# EAGLE schematic Placa_main_f3 (EAGLE 9.6.2)

## Sheet 1 of 7
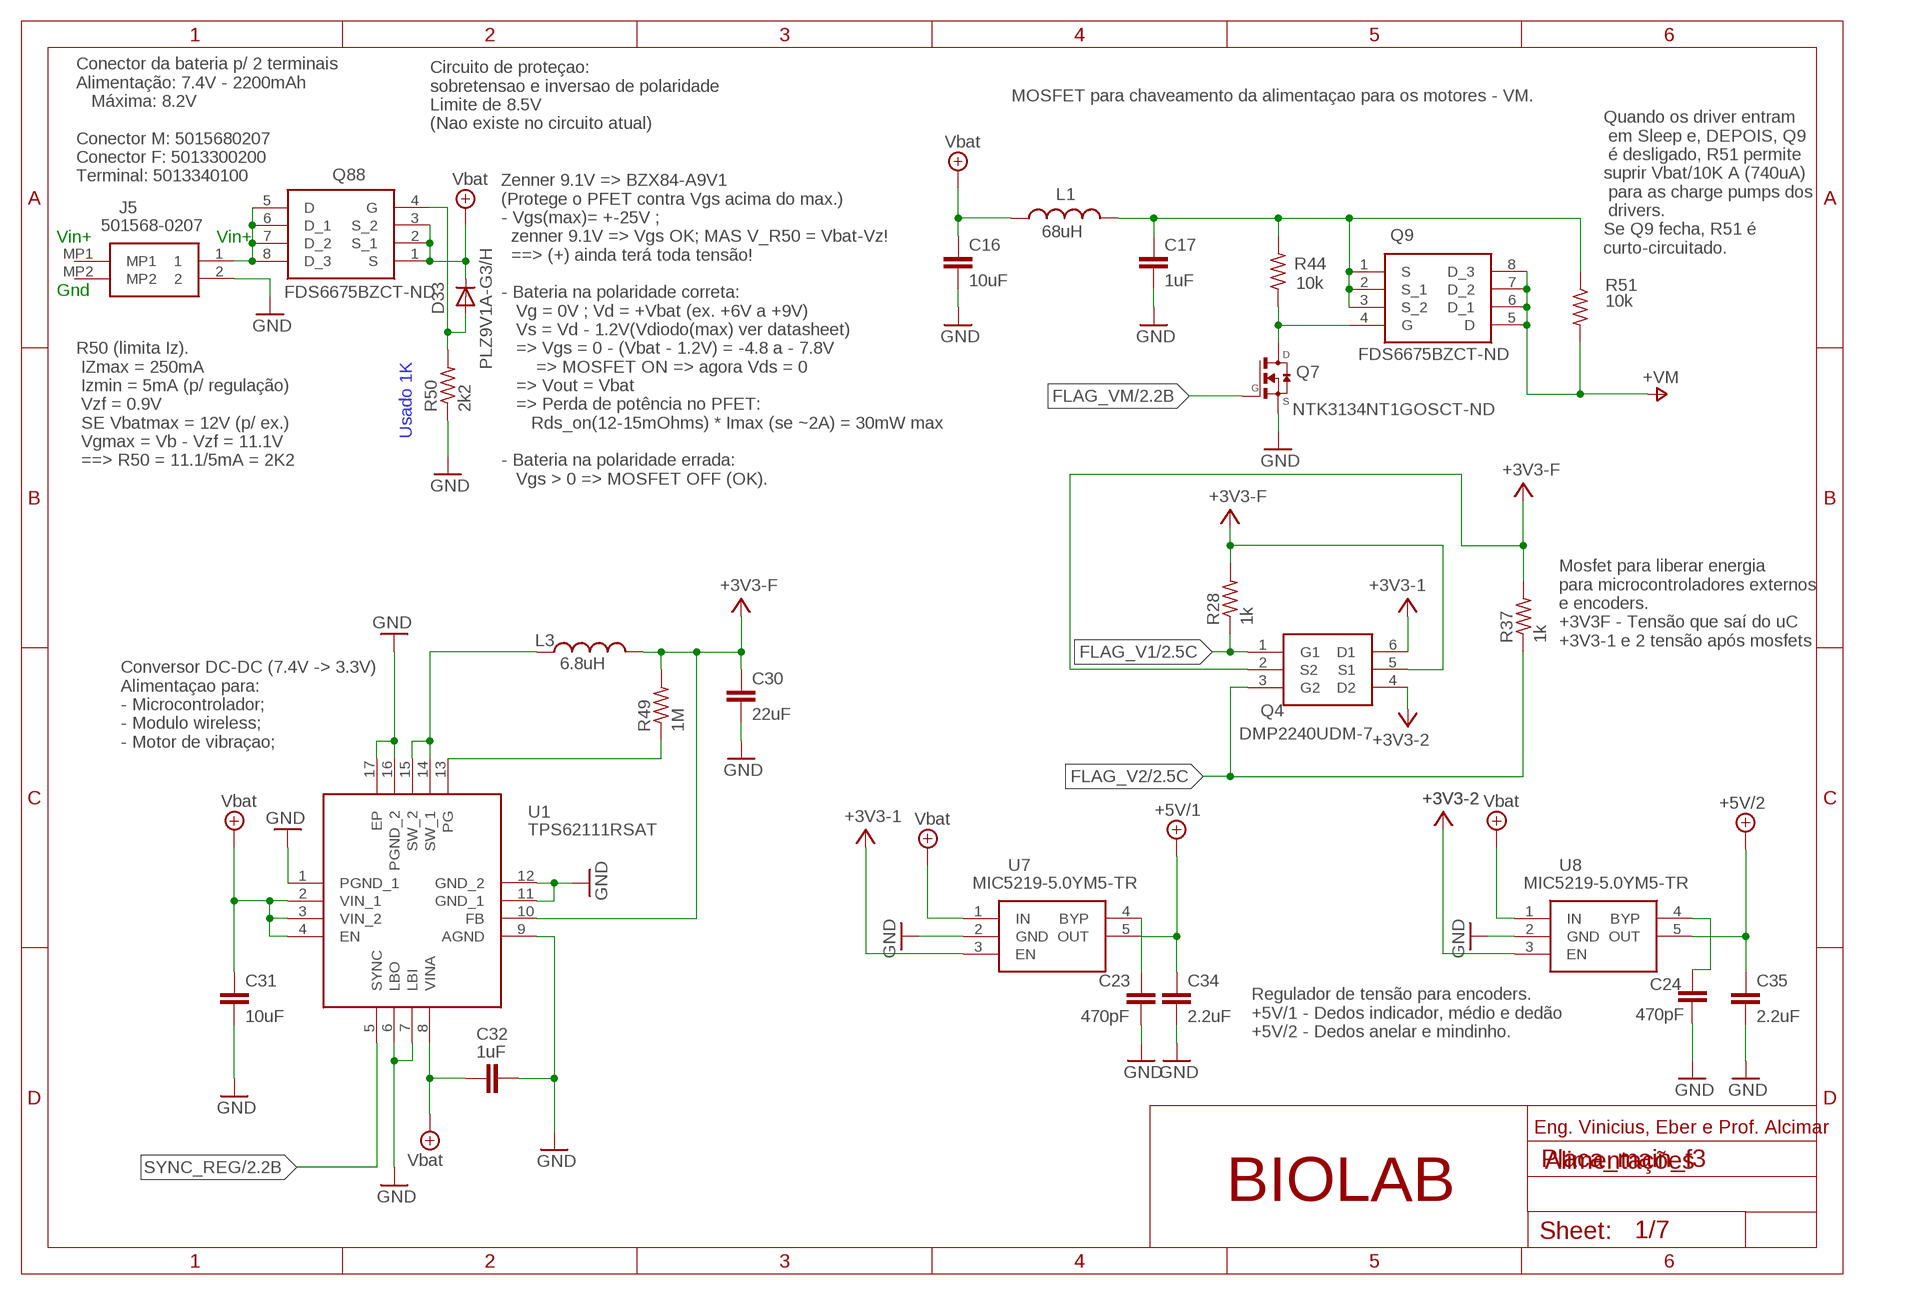
[diagram p0: schematic, sheet 1]

### Parts
C16  10uF  C-EUC0805K  [C0805K]
C17  1uF  C-EUC0402K  [C0402K]
C23  470pF  C-EUC0402K  [C0402K]
C24  470pF  C-EUC0402K  [C0402K]
C30  22uF  C-EUC0805K  [C0805K]
C31  10uF  C-EUC0805K  [C0805K]
C32  1uF  C-EUC0402K  [C0402K]
C34  2.2uF  C-EUC0402K  [C0402K]
C35  2.2uF  C-EUC0402K  [C0402K]
D33  PLZ9V1A-G3/H  DIODE-MINIMELF  [MINIMELF]
J5  501568-0207  [5015680207]
L1  68uH  L-USL2825P  [L2825P]
L3  6.8uH  L-USL2825P  [L2825P]
Q4  DMP2240UDM-7  [SOT95P285X140-6N]
Q7  NTK3134NT1GOSCT-ND  FDV303N  [SOT23]
Q9  FDS6675BZCT-ND  FDS6675BZ  [SOIC127P600X175-8N]
Q88  FDS6675BZCT-ND  FDS6675BZ  [SOIC127P600X175-8N]
R28  1k  R-US_R0402  [R0402]
R37  1k  R-US_R0402  [R0402]
R44  10k  R-US_R0402  [R0402]
R49  1M  R-US_R0402  [R0402]
R50  2k2  R-US_R0402  [R0402]
R51  10k  R-US_R0402  [R0402]
U1  TPS62111RSAT  [QFN65P400X400X100-17N]
U7  MIC5219-5.0YM5-TR  [SOT95P280X145-5N]
U8  MIC5219-5.0YM5-TR  [SOT95P280X145-5N]

### Nets
+3V3: C30.1 L3.2 Q4.2(S2) Q4.5(S1) R28.2 R37.2 R49.2 U1.10(FB) U7.3(EN) ; supply symbol labelled +3V3-F, +3V3-1 ; also sheet 2,3,5,6,7
+3V3-1: Q4.6(D1) ; also sheet 4
+3V3-2: Q4.4(D2) U8.3(EN) ; also sheet 4
+5V/1: C34.1 U7.5(OUT) ; also sheet 3,4
+5V/2: C35.1 U8.5(OUT) ; also sheet 4
FLAG_V1: Q4.1(G1) R28.1 ; also sheet 2
FLAG_V2: Q4.3(G2) R37.1 ; also sheet 2
FLAG_VM: Q7.1(G) ; also sheet 2
GND: C16.2 C17.2 C23.2 C24.2 C30.2 C31.2 C32.2 C34.2 C35.2 J5.2 Q7.2(S) R50.1 U1.1(PGND_1) U1.6(LBO) U1.7(LBI) U1.9(AGND) U1.11(GND_1) U1.12(GND_2) U1.16(PGND_2) U1.17(EP) U7.2(GND) U8.2(GND) ; also sheet 2,3,4,5,6,7
N$9: C17.1 L1.2 Q9.1(S) Q9.2(S_1) Q9.3(S_2) R44.2 R51.1
N$10: Q7.3(D) Q9.4(G) R44.1
N$11: C24.1 U8.4(BYP)
N$12: C23.1 U7.4(BYP)
N$14: R49.1 U1.13(PG)
N$15: L3.1 U1.14(SW_1) U1.15(SW_2)
N$16: D33.A Q88.4(G) R50.2
SYNC_REG: U1.5(SYNC) ; also sheet 2
V+: Q9.5(D) Q9.6(D_1) Q9.7(D_2) Q9.8(D_3) R51.2 ; supply symbol labelled +VM ; also sheet 3,4,5
VBAT: C16.1 C31.1 C32.1 D33.C L1.1 Q88.1(S) Q88.2(S_1) Q88.3(S_2) U1.2(VIN_1) U1.3(VIN_2) U1.4(EN) U1.8(VINA) U7.1(IN) U8.1(IN) ; supply symbol labelled Vbat ; also sheet 2
VIN+: J5.1 Q88.5(D) Q88.6(D_1) Q88.7(D_2) Q88.8(D_3)
Unconnected: J5.MP1 J5.MP2

### Notes on the sheet
- MOSFET para chaveamento da alimentaçao para os motores - VM.
- Circuito de proteçao: 
  sobretensao e inversao de polaridade
  Limite de 8.5V
  (Nao existe no circuito atual)
- Conector da bateria p/ 2 terminais
  Alimentação: 7.4V - 2200mAh
     Máxima: 8.2V
  
  Conector M: 5015680207
  Conector F: 5013300200
  Terminal: 5013340100
- Vin+ | Vin+
- Quando os driver entram
   em Sleep e, DEPOIS, Q9
   é desligado, R51 permite 
  suprir Vbat/10K A (740uA)
   para as charge pumps dos
   drivers.
  Se Q9 fecha, R51 é 
  curto-circuitado.
- Gnd
- Usado 1K
- R50 (limita Iz). 
   IZmax = 250mA
   Izmin = 5mA (p/ regulação)
   Vzf = 0.9V 
   SE Vbatmax = 12V (p/ ex.)
   Vgmax = Vb - Vzf = 11.1V 
   ==> R50 = 11.1/5mA = 2K2
- Zenner 9.1V => BZX84-A9V1 
  (Protege o PFET contra Vgs acima do max.) 
  - Vgs(max)= +-25V ; 
    zenner 9.1V => Vgs OK; MAS V_R50 = Vbat-Vz!
    ==> (+) ainda terá toda tensão!
  
  - Bateria na polaridade correta:
     Vg = 0V ; Vd = +Vbat (ex. +6V a +9V)
     Vs = Vd - 1.2V(Vdiodo(max) ver datasheet)
     => Vgs = 0 - (Vbat - 1.2V) = -4.8 a - 7.8V
         => MOSFET ON => agora Vds = 0
     => Vout = Vbat   
     => Perda de potência no PFET:
        Rds_on(12-15mOhms) * Imax (se ~2A) = 30mW max 
   
  - Bateria na polaridade errada:
     Vgs > 0 => MOSFET OFF (OK).
- Mosfet para liberar energia 
  para microcontroladores externos
  e encoders.
  +3V3F - Tensão que saí do uC
  +3V3-1 e 2 tensão após mosfets
- Conversor DC-DC (7.4V -> 3.3V) 
  Alimentaçao para:
  - Microcontrolador;
  - Modulo wireless;
  - Motor de vibraçao;
- Regulador de tensão para encoders.
  +5V/1 - Dedos indicador, médio e dedão
  +5V/2 - Dedos anelar e mindinho.
- Eng. Vinicius, Eber e Prof. Alcimar
- Alimentações
- BIOLAB

## Sheet 2 of 7
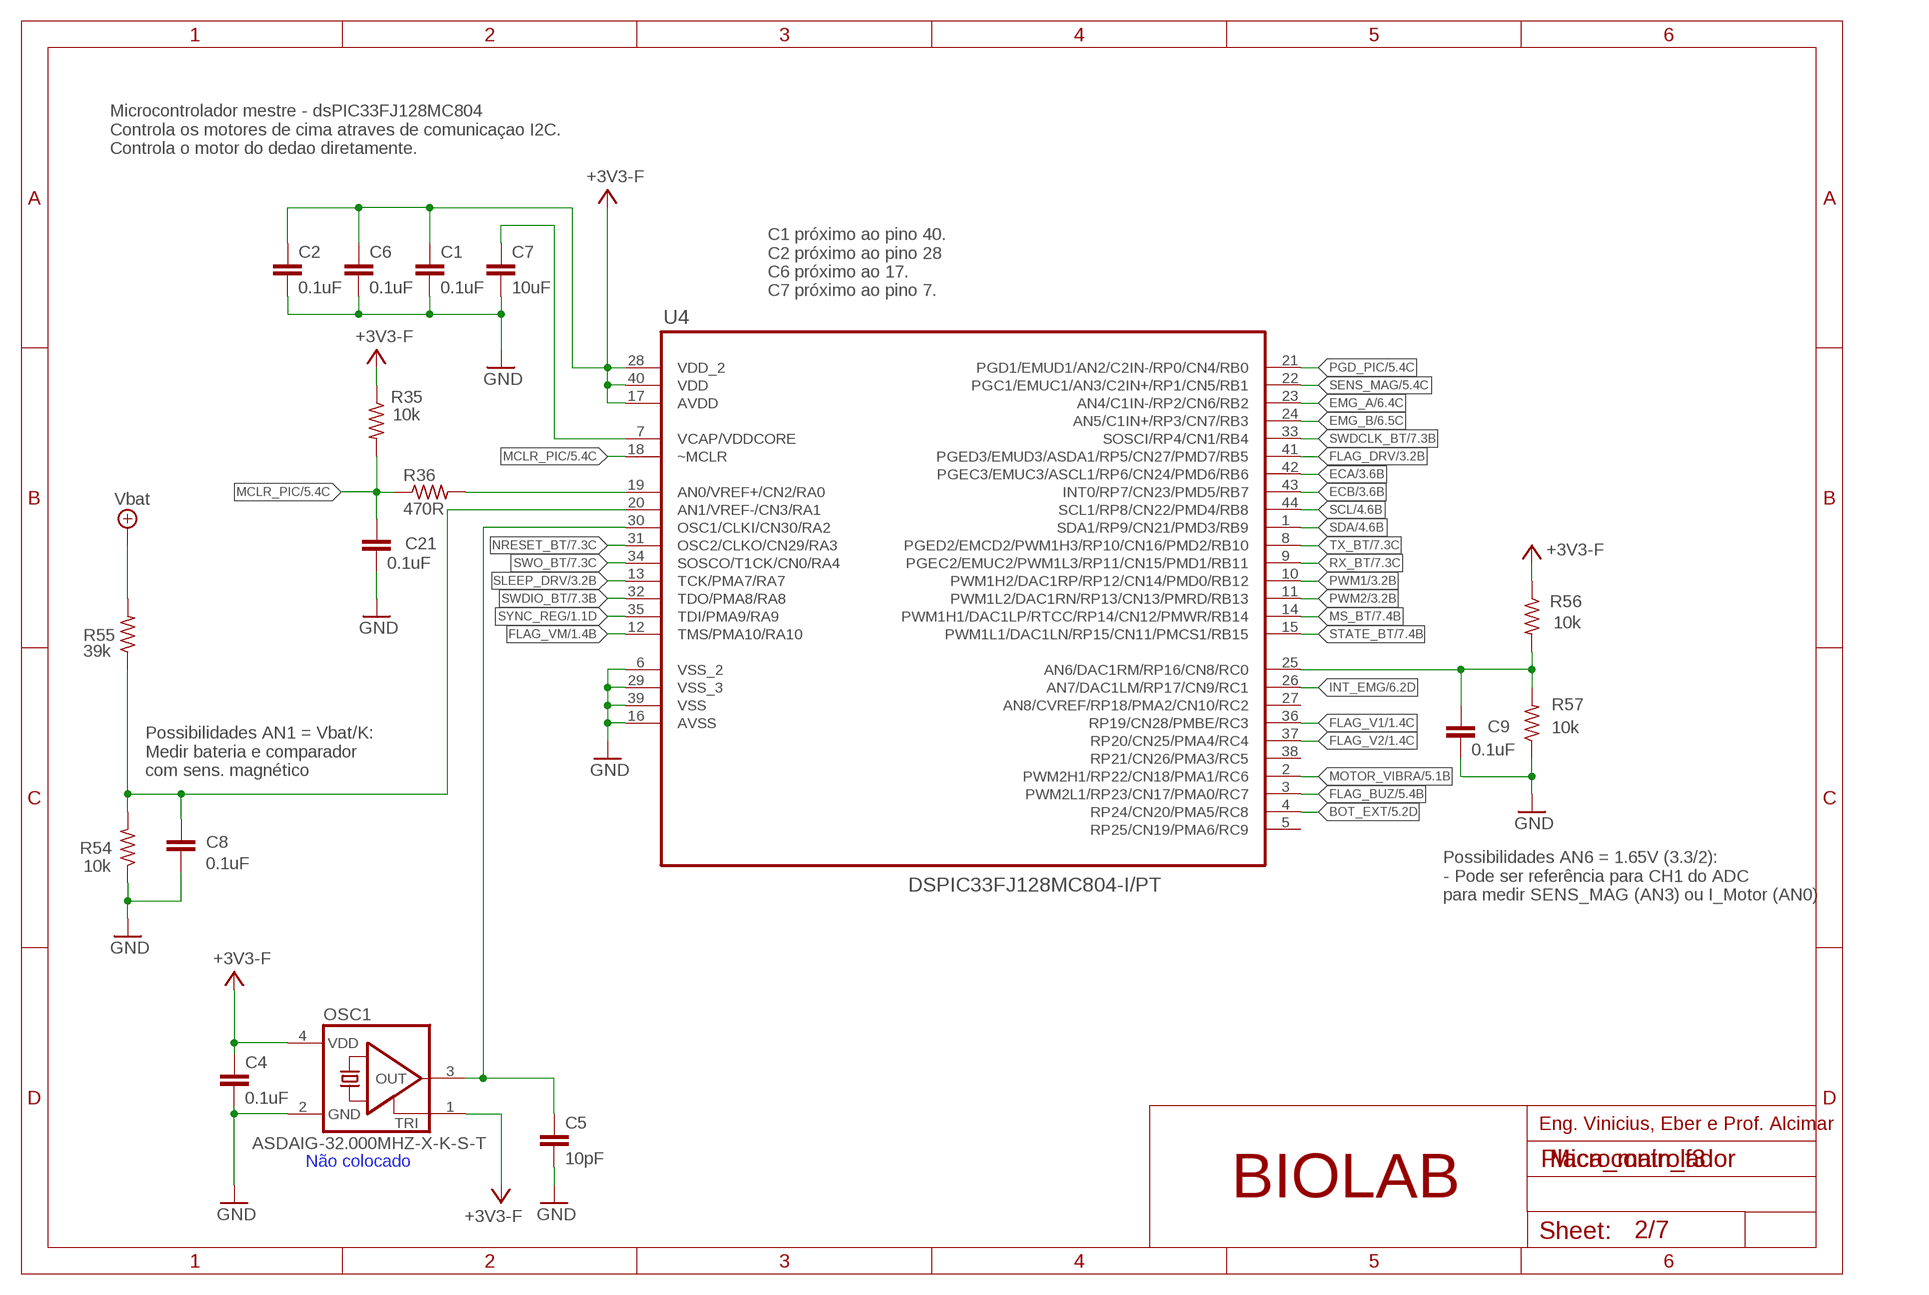
[diagram p1: schematic, sheet 2]

### Parts
C1  0.1uF  C-EUC0402K  [C0402K]
C2  0.1uF  C-EUC0402K  [C0402K]
C4  0.1uF  C-EUC0402K  [C0402K]
C5  10pF  C-EUC0402K  [C0402K]
C6  0.1uF  C-EUC0402K  [C0402K]
C7  10uF  C-EUC0805K  [C0805K]
C8  0.1uF  C-EUC0402K  [C0402K]
C9  0.1uF  C-EUC0402K  [C0402K]
C21  0.1uF  C-EUC0402K  [C0402K]
OSC1  ASDAIG-32.000MHZ-X-K-S-T  ASE  [ASE]
R35  10k  R-US_R0402  [R0402]
R36  470R  R-US_R0402  [R0402]
R54  10k  R-US_R0402  [R0402]
R55  39k  R-US_R0402  [R0402]
R56  10k  R-US_R0402  [R0402]
R57  10k  R-US_R0402  [R0402]
U4  DSPIC33FJ128MC804-I/PT  [QFP80P1200X1200X120-44N]

### Nets
+3V3: C1.1 C2.1 C4.1 C6.1 OSC1.1(TRI) OSC1.4(VDD) R35.1 R56.1 U4.17(AVDD) U4.28(VDD_2) U4.40(VDD) ; supply symbol labelled +3V3-F ; also sheet 1,3,5,6,7
BOT_EXT: U4.4(RP24/CN20/PMA5/RC8) ; also sheet 5
ECA: U4.42(PGEC3/EMUC3/ASCL1/RP6/CN24/PMD6/RB6) ; also sheet 3
ECB: U4.43(INT0/RP7/CN23/PMD5/RB7) ; also sheet 3
EMG_A: U4.23(AN4/C1IN-/RP2/CN6/RB2) ; also sheet 6
EMG_B: U4.24(AN5/C1IN+/RP3/CN7/RB3) ; also sheet 6
FLAG_BUZ: U4.3(PWM2L1/RP23/CN17/PMA0/RC7) ; also sheet 5
FLAG_DRV: U4.41(PGED3/EMUD3/ASDA1/RP5/CN27/PMD7/RB5) ; also sheet 3
FLAG_V1: U4.36(RP19/CN28/PMBE/RC3) ; also sheet 1
FLAG_V2: U4.37(RP20/CN25/PMA4/RC4) ; also sheet 1
FLAG_VM: U4.12(TMS/PMA10/RA10) ; also sheet 1
GND: C1.2 C2.2 C4.2 C5.2 C6.2 C7.2 C8.2 C9.2 C21.2 OSC1.2(GND) R54.1 R57.1 U4.6(VSS_2) U4.16(AVSS) U4.29(VSS_3) U4.39(VSS) ; also sheet 1,3,4,5,6,7
INT_EMG: U4.26(AN7/DAC1LM/RP17/CN9/RC1) ; also sheet 6
MCLR_PIC: C21.1 R35.2 R36.1 U4.18(~MCLR) ; also sheet 5
MOTOR_VIBRA: U4.2(PWM2H1/RP22/CN18/PMA1/RC6) ; also sheet 5
MS_BT: U4.14(PWM1H1/DAC1LP/RTCC/RP14/CN12/PMWR/RB14) ; also sheet 7
N$3: C7.1 U4.7(VCAP/VDDCORE)
N$4: C9.1 R56.2 R57.2 U4.25(AN6/DAC1RM/RP16/CN8/RC0)
N$19: C8.1 R54.2 R55.1 U4.20(AN1/VREF-/CN3/RA1)
N$22: C5.1 OSC1.3(OUT) U4.30(OSC1/CLKI/CN30/RA2)
N$23: R36.2 U4.19(AN0/VREF+/CN2/RA0)
NRESET_BT: U4.31(OSC2/CLKO/CN29/RA3) ; also sheet 7
PGD_PIC: U4.21(PGD1/EMUD1/AN2/C2IN-/RP0/CN4/RB0) ; also sheet 5
PWM1: U4.10(PWM1H2/DAC1RP/RP12/CN14/PMD0/RB12) ; also sheet 3
PWM2: U4.11(PWM1L2/DAC1RN/RP13/CN13/PMRD/RB13) ; also sheet 3
RX_BT: U4.9(PGEC2/EMUC2/PWM1L3/RP11/CN15/PMD1/RB11) ; also sheet 7
SCL: U4.44(SCL1/RP8/CN22/PMD4/RB8) ; also sheet 4,6
SDA: U4.1(SDA1/RP9/CN21/PMD3/RB9) ; also sheet 4,6
SENS_MAG: U4.22(PGC1/EMUC1/AN3/C2IN+/RP1/CN5/RB1) ; also sheet 5
SLEEP_DRV: U4.13(TCK/PMA7/RA7) ; also sheet 3
STATE_BT: U4.15(PWM1L1/DAC1LN/RP15/CN11/PMCS1/RB15) ; also sheet 7
SWDCLK_BT: U4.33(SOSCI/RP4/CN1/RB4) ; also sheet 7
SWDIO_BT: U4.32(TDO/PMA8/RA8) ; also sheet 7
SWO_BT: U4.34(SOSCO/T1CK/CN0/RA4) ; also sheet 7
SYNC_REG: U4.35(TDI/PMA9/RA9) ; also sheet 1
TX_BT: U4.8(PGED2/EMCD2/PWM1H3/RP10/CN16/PMD2/RB10) ; also sheet 7
VBAT: R55.2 ; supply symbol labelled Vbat ; also sheet 1
Unconnected: U4.5(RP25/CN19/PMA6/RC9) U4.27(AN8/CVREF/RP18/PMA2/CN10/RC2) U4.38(RP21/CN26/PMA3/RC5)

### Notes on the sheet
- Microcontrolador mestre - dsPIC33FJ128MC804
  Controla os motores de cima atraves de comunicaçao I2C.
  Controla o motor do dedao diretamente.
- C1 próximo ao pino 40.
  C2 próximo ao pino 28
  C6 próximo ao 17.
  C7 próximo ao pino 7.
- Possibilidades AN1 = Vbat/K:
  Medir bateria e comparador 
  com sens. magnético
- Possibilidades AN6 = 1.65V (3.3/2):
  - Pode ser referência para CH1 do ADC 
  para medir SENS_MAG (AN3) ou I_Motor (AN0)
- Eng. Vinicius, Eber e Prof. Alcimar
- Não colocado | Microcontrolador
- BIOLAB

## Sheet 3 of 7
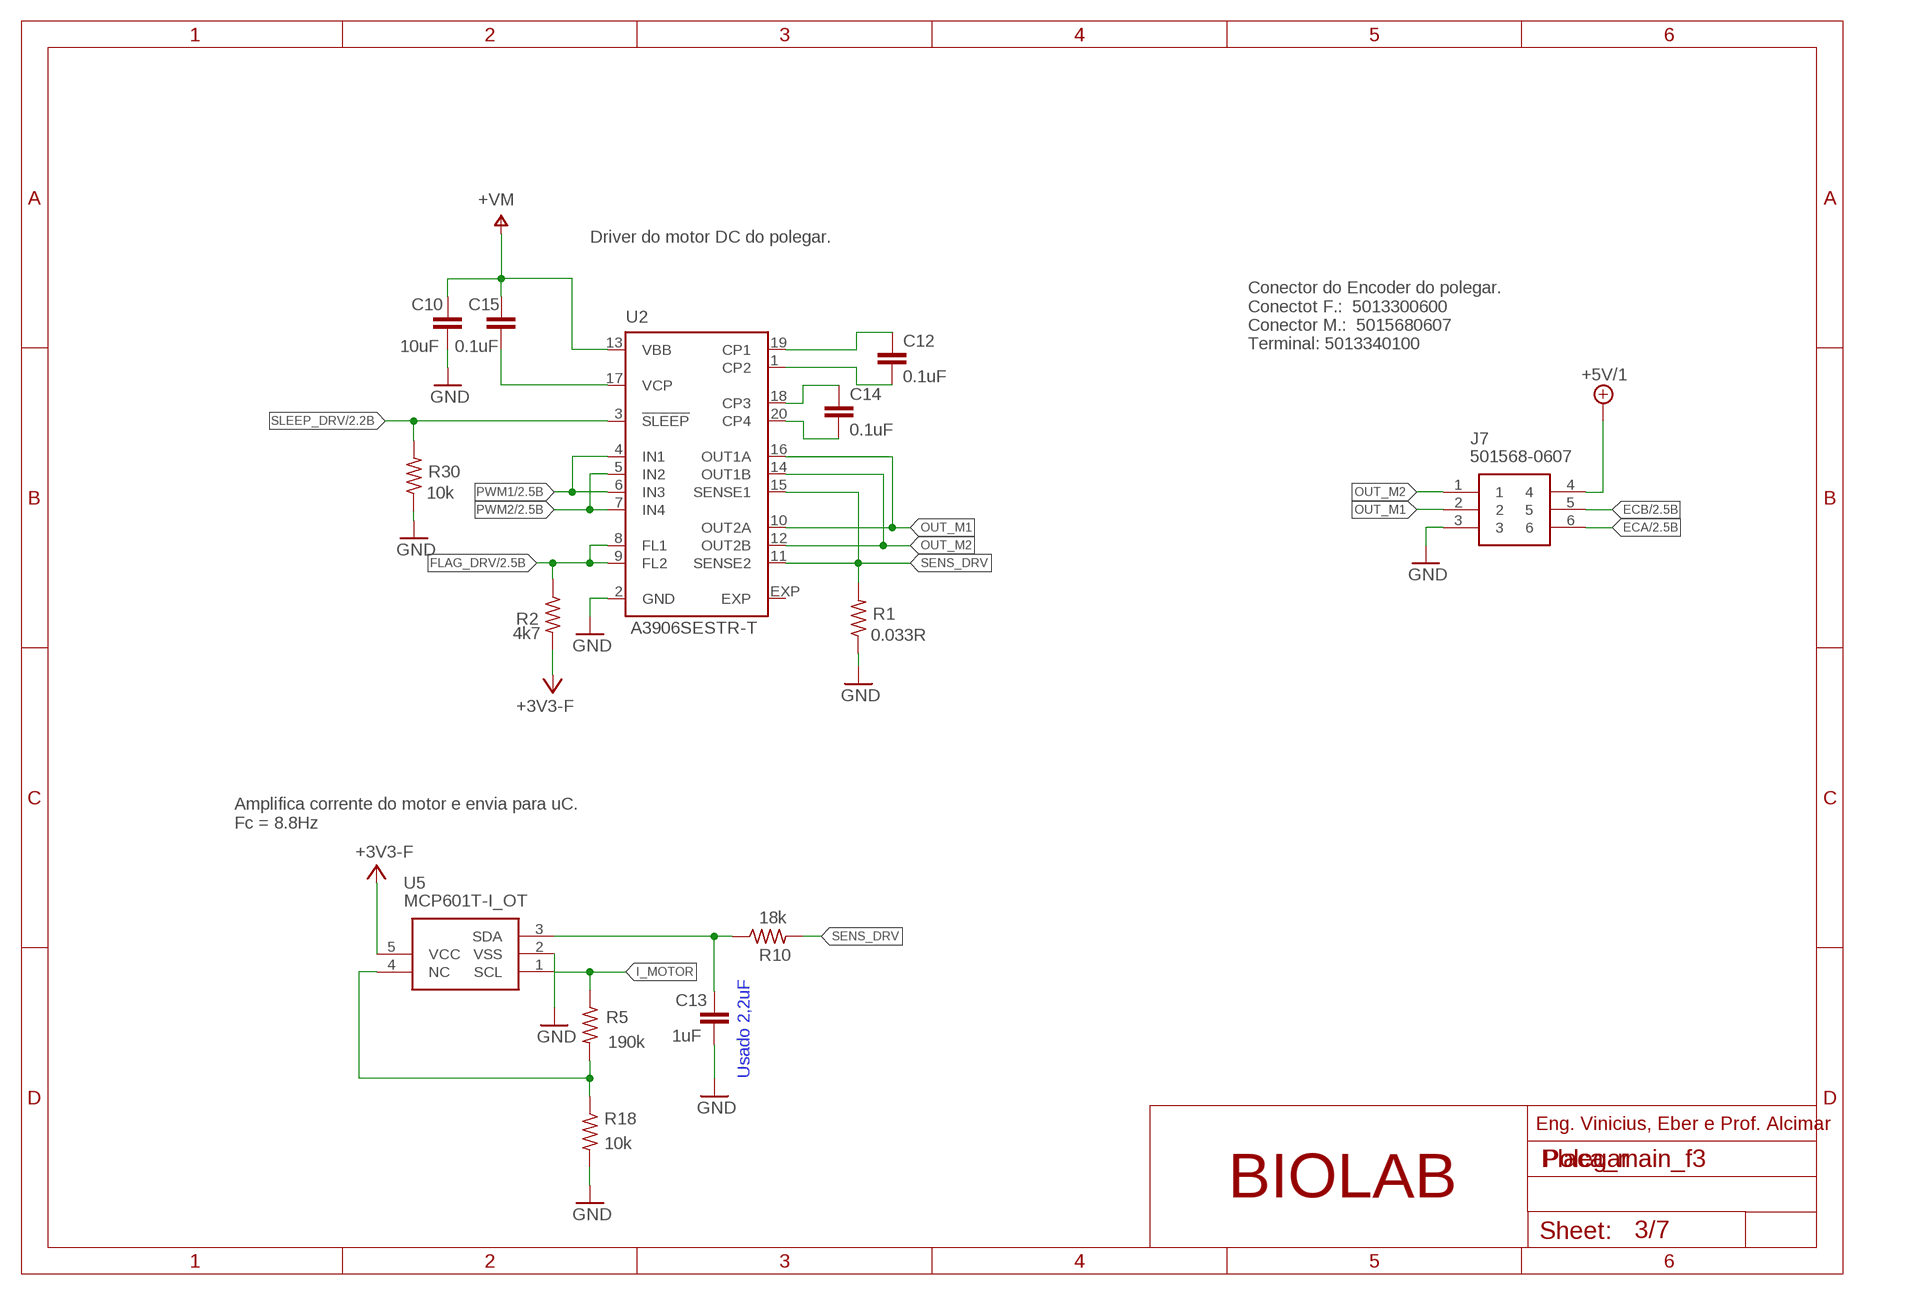
[diagram p2: schematic, sheet 3]

### Parts
C10  10uF  C-EUC0805K  [C0805K]
C12  0.1uF  C-EUC0402K  [C0402K]
C13  1uF  C-EUC0402K  [C0402K]
C14  0.1uF  C-EUC0402K  [C0402K]
C15  0.1uF  C-EUC0402K  [C0402K]
J7  501568-0607  [501568-0607]
R1  0.033R  R-US_R0805  [R0805]
R2  4k7  R-US_R0402  [R0402]
R5  190k  R-US_R0402  [R0402]
R10  18k  R-US_R0402  [R0402]
R18  10k  R-US_R0402  [R0402]
R30  10k  R-US_R0402  [R0402]
U2  A3906SESTR-T  A3906  [QFN20]
U5  MCP601T-I_OT  [SOT95P270X145-5N]

### Nets
+3V3: R2.2 U5.5(VCC) ; supply symbol labelled +3V3-F ; also sheet 1,2,5,6,7
+5V/1: J7.4 ; also sheet 1,4
ECA: J7.6 ; also sheet 2
ECB: J7.5 ; also sheet 2
FLAG_DRV: R2.1 U2.8(FL1) U2.9(FL2) ; also sheet 2
GND: C10.1 C13.2 J7.3 R1.1 R18.2 R30.1 U2.2(GND) U5.2(VSS) ; also sheet 1,2,4,5,6,7
I_MOTOR: R5.1 U5.1(SCL)
N$8: C13.1 R10.1 U5.3(SDA)
N$13: C12.2 U2.1(CP2)
N$17: C14.1 U2.18(CP3)
N$20: C15.2 U2.17(VCP)
N$21: C14.2 U2.20(CP4)
N$25: C12.1 U2.19(CP1)
N$26: R5.2 R18.1 U5.4(NC)
OUT_M1: J7.2 U2.10(OUT2A) U2.16(OUT1A)
OUT_M2: J7.1 U2.12(OUT2B) U2.14(OUT1B)
PWM1: U2.4(IN1) U2.6(IN3) ; also sheet 2
PWM2: U2.5(IN2) U2.7(IN4) ; also sheet 2
SENS_DRV: R1.2 R10.2 U2.11(SENSE2) U2.15(SENSE1)
SLEEP_DRV: R30.2 U2.3(!SLEEP) ; also sheet 2
V+: C10.2 C15.1 U2.13(VBB) ; supply symbol labelled +VM ; also sheet 1,4,5
Unconnected: U2.EXP

### Notes on the sheet
- Driver do motor DC do polegar.
- Conector do Encoder do polegar.
  Conectot F.:  5013300600
  Conector M.:  5015680607 
  Terminal: 5013340100
- Amplifica corrente do motor e envia para uC.
  Fc = 8.8Hz
- Usado 2,2uF
- Eng. Vinicius, Eber e Prof. Alcimar
- Polegar
- BIOLAB

## Sheet 4 of 7
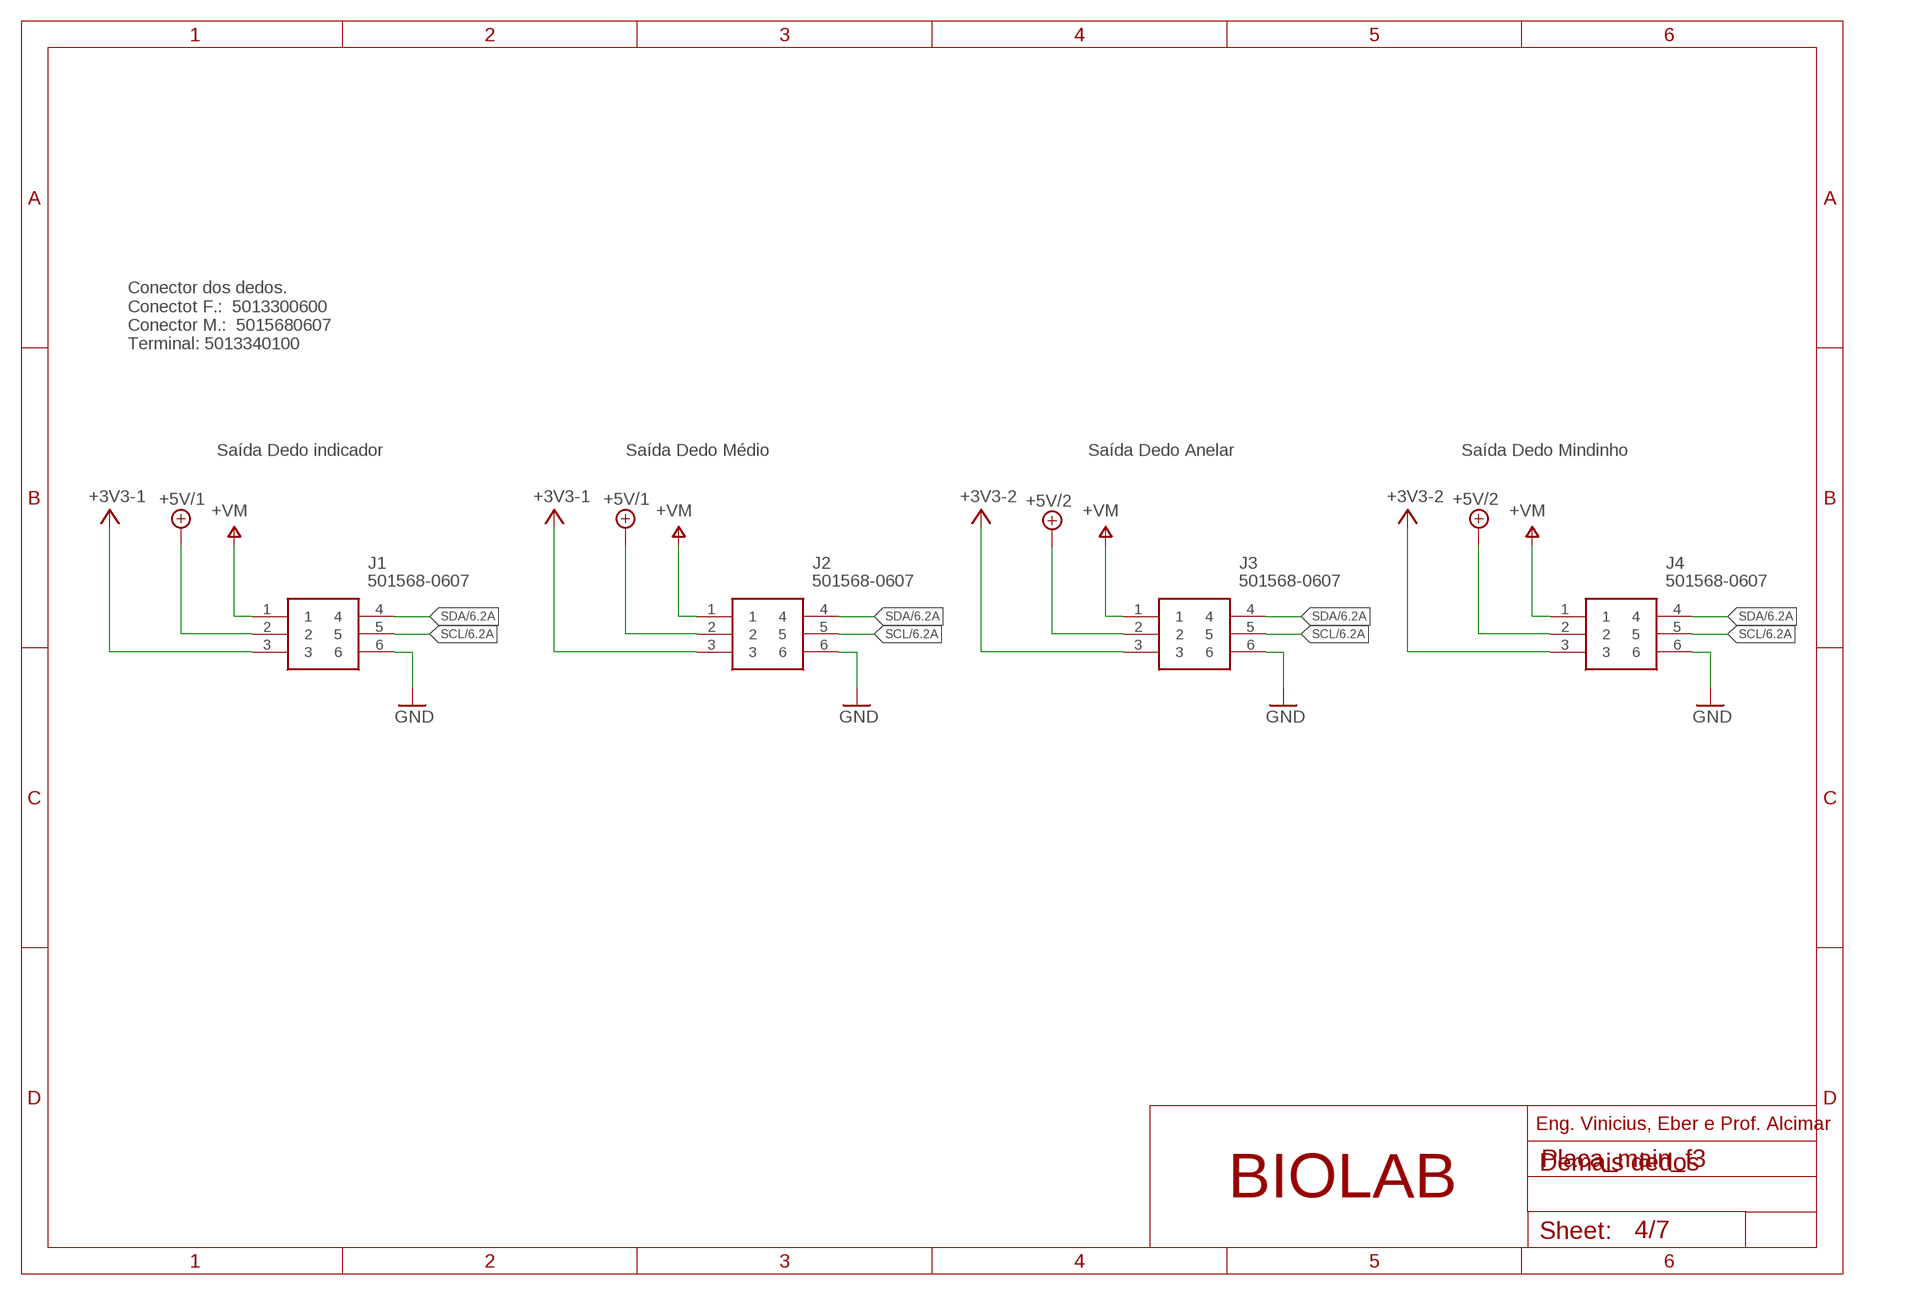
[diagram p3: schematic, sheet 4]

### Parts
J1  501568-0607  [501568-0607]
J2  501568-0607  [501568-0607]
J3  501568-0607  [501568-0607]
J4  501568-0607  [501568-0607]

### Nets
+3V3-1: J1.3 J2.3 ; also sheet 1
+3V3-2: J3.3 J4.3 ; also sheet 1
+5V/1: J1.2 J2.2 ; also sheet 1,3
+5V/2: J3.2 J4.2 ; also sheet 1
GND: J1.6 J2.6 J3.6 J4.6 ; also sheet 1,2,3,5,6,7
SCL: J1.5 J2.5 J3.5 J4.5 ; also sheet 2,6
SDA: J1.4 J2.4 J3.4 J4.4 ; also sheet 2,6
V+: J1.1 J2.1 J3.1 J4.1 ; supply symbol labelled +VM ; also sheet 1,3,5

### Notes on the sheet
- Conector dos dedos.
  Conectot F.:  5013300600
  Conector M.:  5015680607 
  Terminal: 5013340100
- Saída Dedo indicador | Saída Dedo Médio | Saída Dedo Anelar | Saída Dedo Mindinho
- Eng. Vinicius, Eber e Prof. Alcimar
- Demais dedos
- BIOLAB

## Sheet 5 of 7
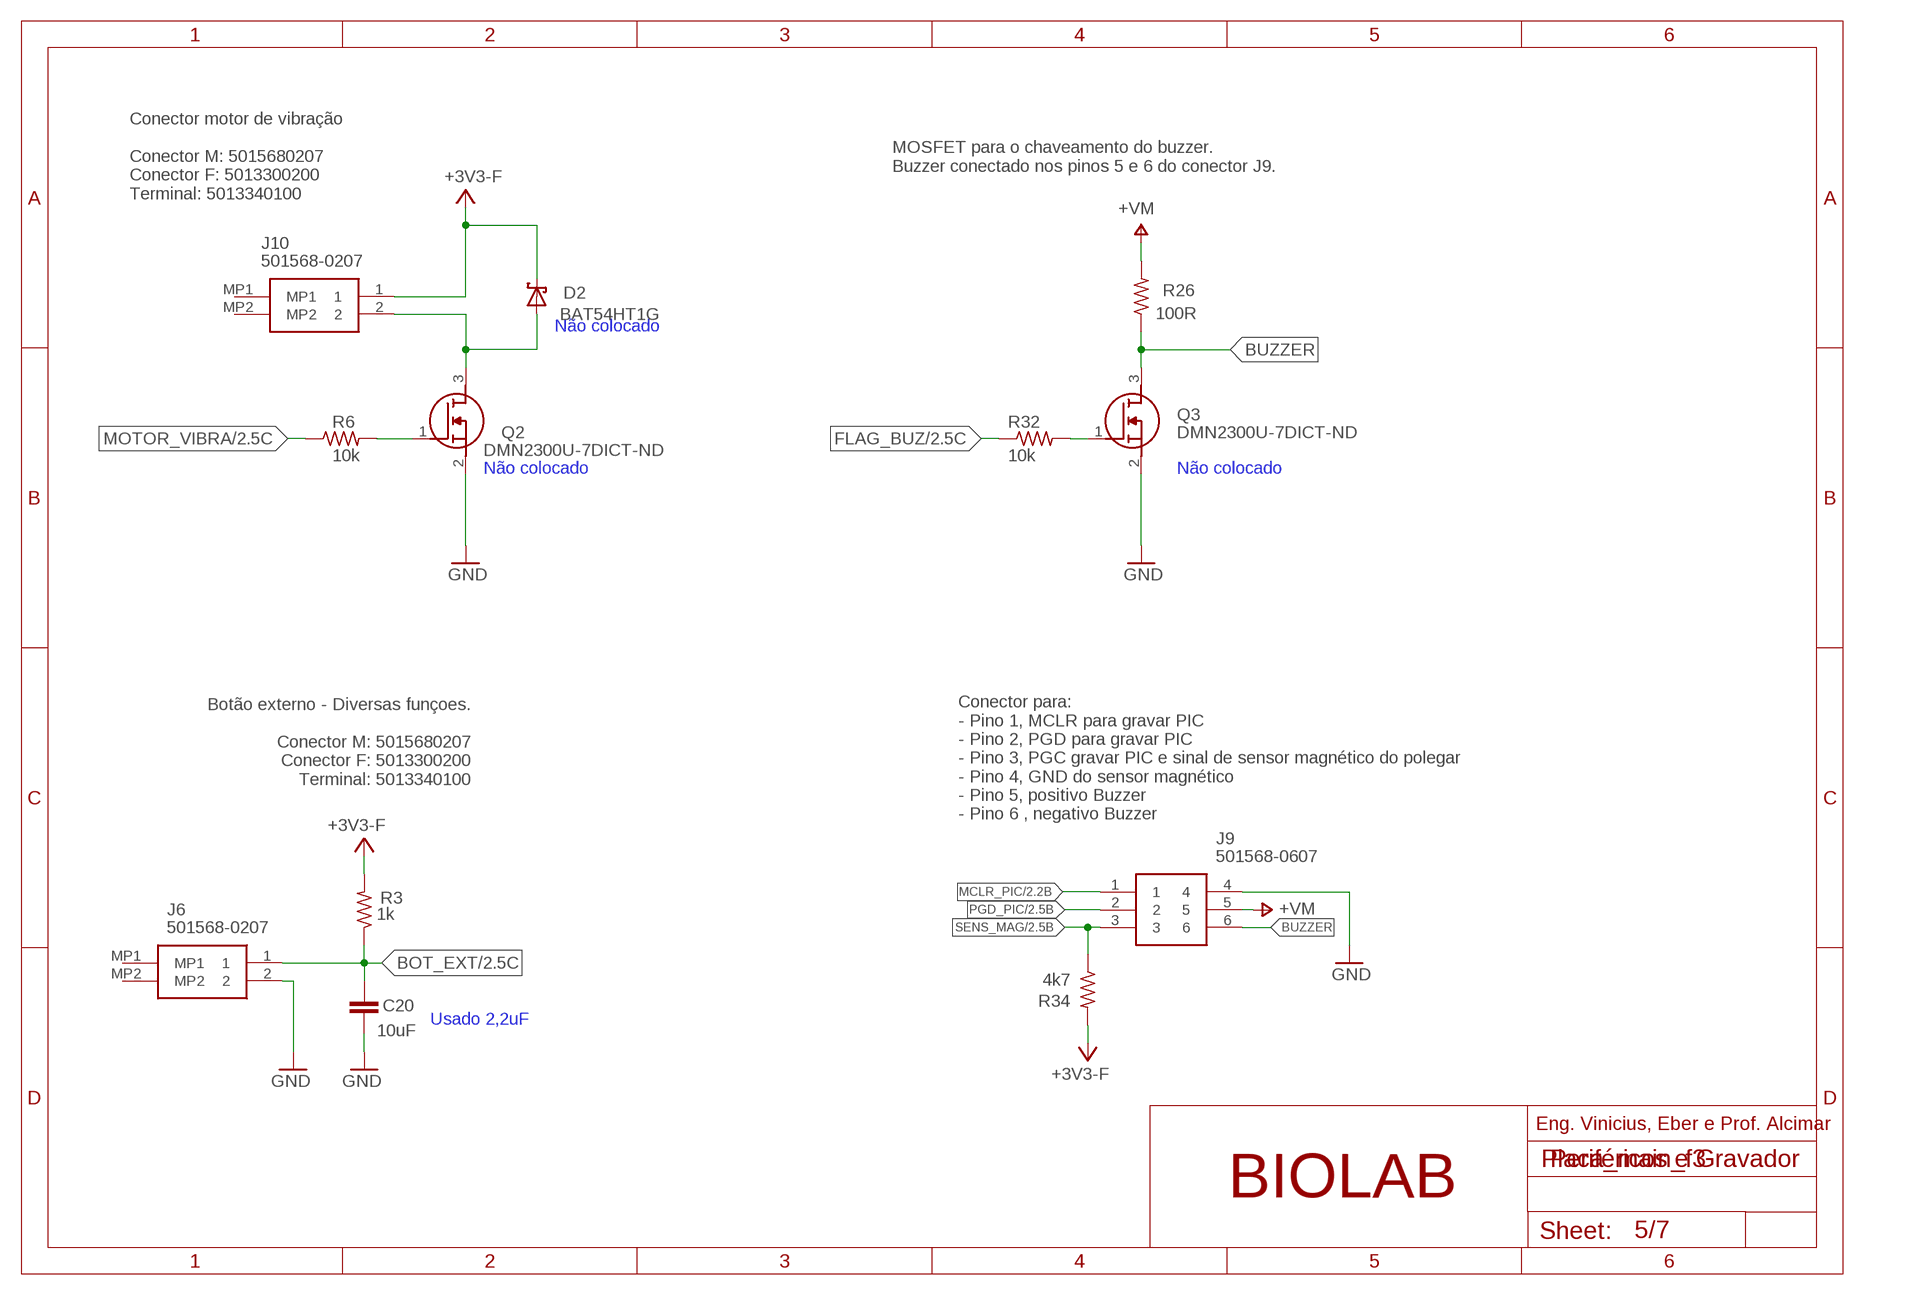
[diagram p4: schematic, sheet 5]

### Parts
C20  10uF  C-EUC0402K  [C0402K]
D2  BAT54HT1G  BAT54  [SOT23]
J6  501568-0207  [5015680207]
J9  501568-0607  [501568-0607]
J10  501568-0207  [5015680207]
Q2  DMN2300U-7DICT-ND  DMN2300U-7  [SOT96P240X110-3N]
Q3  DMN2300U-7DICT-ND  DMN2300U-7  [SOT96P240X110-3N]
R3  1k  R-US_R0402  [R0402]
R6  10k  R-US_R0402  [R0402]
R26  100R  R-US_R0402  [R0402]
R32  10k  R-US_R0402  [R0402]
R34  4k7  R-US_R0402  [R0402]

### Nets
+3V3: D2.3(C) J10.1 R3.2 R34.2 ; supply symbol labelled +3V3-F ; also sheet 1,2,3,6,7
BOT_EXT: C20.1 J6.1 R3.1 ; also sheet 2
BUZZER: J9.6 Q3.3(D) R26.1
FLAG_BUZ: R32.1 ; also sheet 2
GND: C20.2 J6.2 J9.4 Q2.2(S) Q3.2(S) ; also sheet 1,2,3,4,6,7
MCLR_PIC: J9.1 ; also sheet 2
MOTOR_VIBRA: R6.1 ; also sheet 2
N$6: Q2.1(G) R6.2
N$24: D2.1(A) J10.2 Q2.3(D)
N$29: Q3.1(G) R32.2
PGD_PIC: J9.2 ; also sheet 2
SENS_MAG: J9.3 R34.1 ; also sheet 2
V+: J9.5 R26.2 ; supply symbol labelled +VM ; also sheet 1,3,4
Unconnected: J6.MP1 J6.MP2 J10.MP1 J10.MP2

### Notes on the sheet
- MOSFET para o chaveamento do buzzer.
  Buzzer conectado nos pinos 5 e 6 do conector J9.
- Conector motor de vibração
  
  Conector M: 5015680207
  Conector F: 5013300200
  Terminal: 5013340100
- Não colocado
- Não colocado | Não colocado
- Botão externo - Diversas funçoes.
  
  Conector M: 5015680207
  Conector F: 5013300200
  Terminal: 5013340100
- Conector para:
  - Pino 1, MCLR para gravar PIC
  - Pino 2, PGD para gravar PIC
  - Pino 3, PGC gravar PIC e sinal de sensor magnético do polegar
  - Pino 4, GND do sensor magnético
  - Pino 5, positivo Buzzer
  - Pino 6 , negativo Buzzer
- Usado 2,2uF
- Eng. Vinicius, Eber e Prof. Alcimar
- Periféricos e Gravador
- BIOLAB

## Sheet 6 of 7
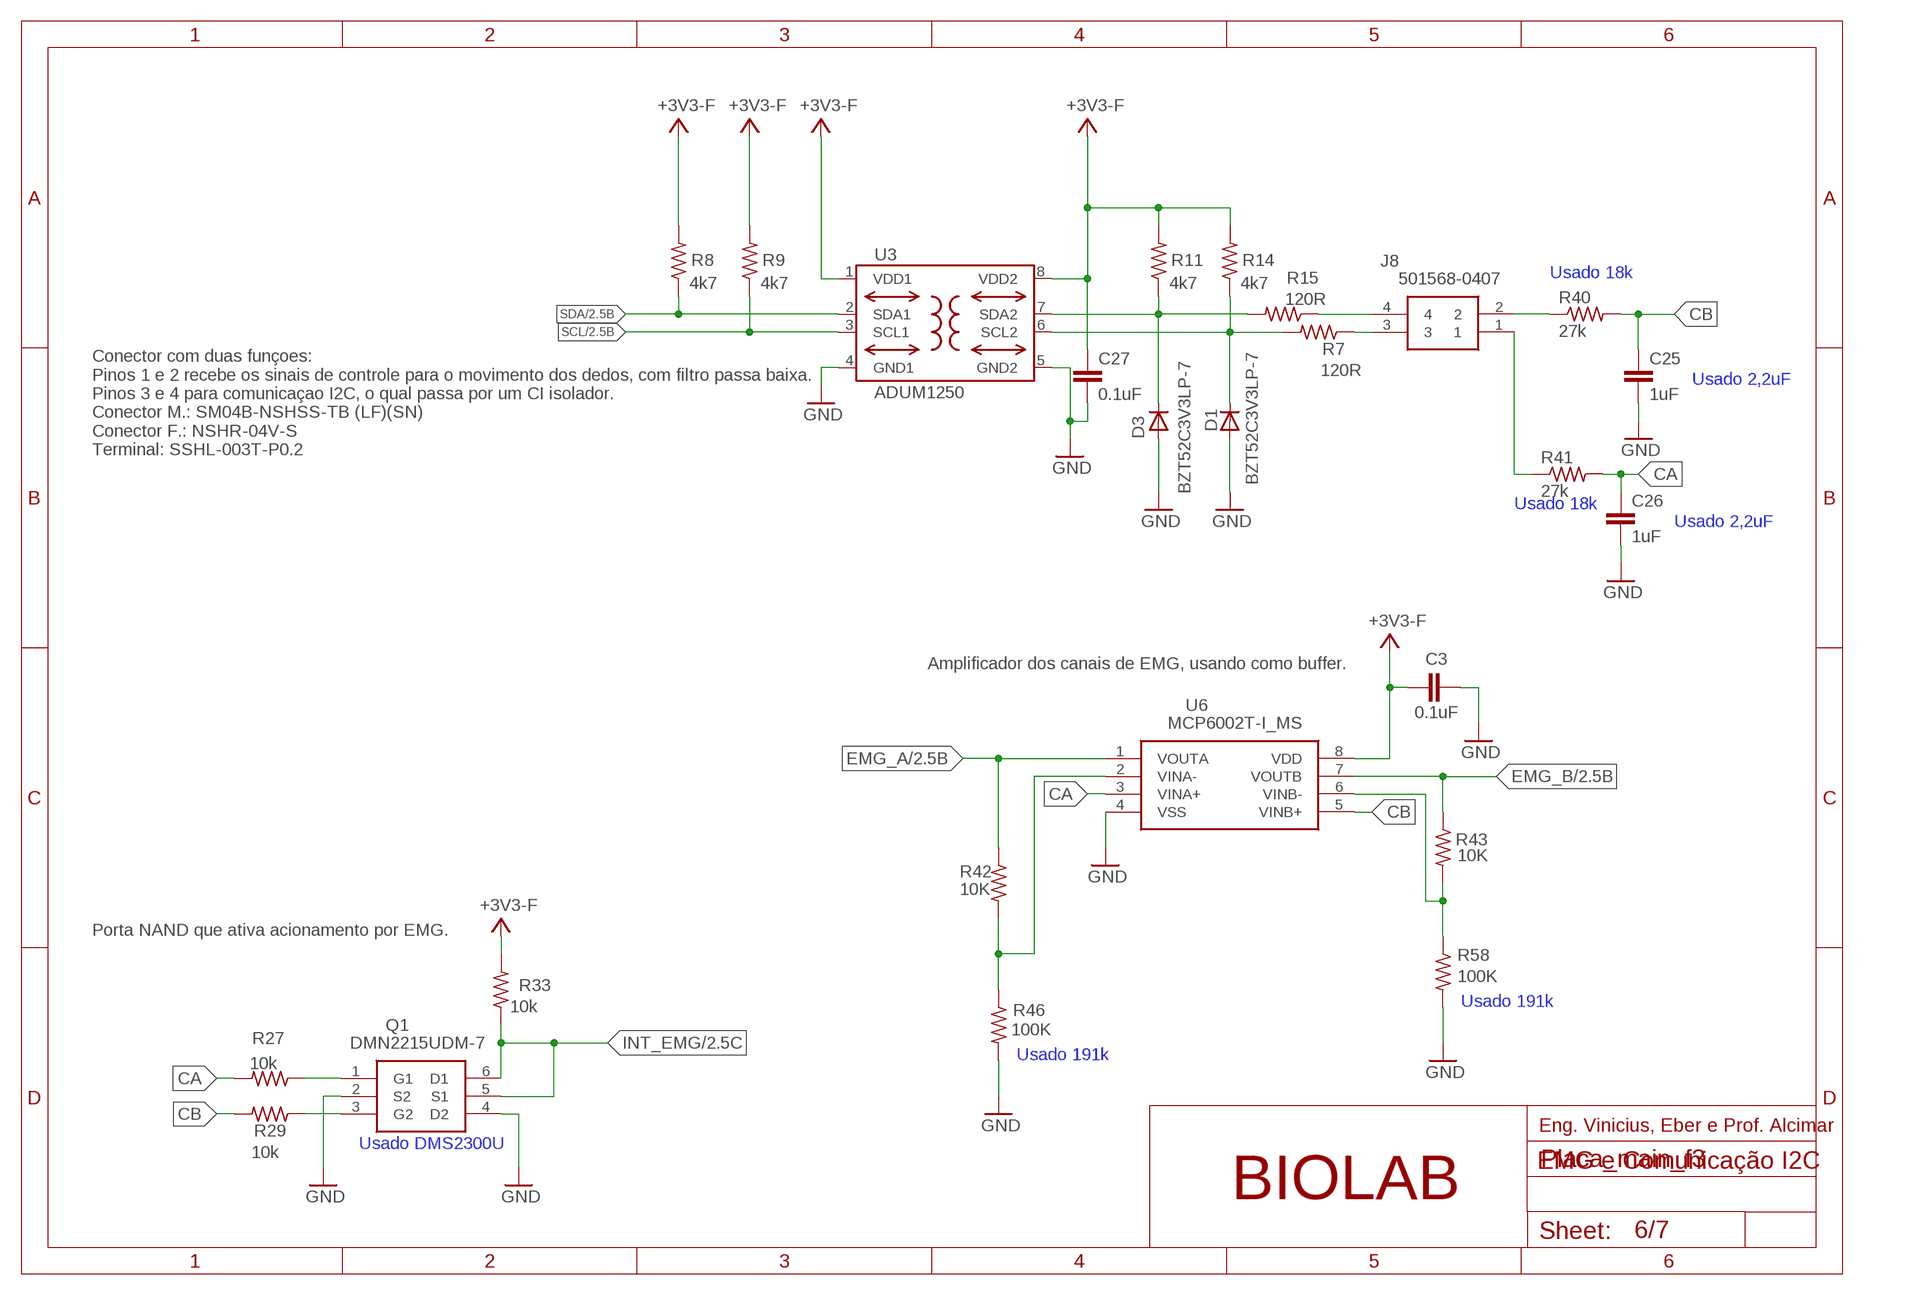
[diagram p5: schematic, sheet 6]

### Parts
C3  0.1uF  C-EUC0402K  [C0402K]
C25  1uF  C-EUC0402K  [C0402K]
C26  1uF  C-EUC0402K  [C0402K]
C27  0.1uF  C-EUC0402K  [C0402K]
D1  BZT52C3V3LP-7  DIODE-MINIMELF  [MINIMELF]
D3  BZT52C3V3LP-7  DIODE-MINIMELF  [MINIMELF]
J8  501568-0407  [501568-0407]
Q1  DMN2215UDM-7  [SOT95P285X140-6N]
R7  120R  R-US_R0402  [R0402]
R8  4k7  R-US_R0402  [R0402]
R9  4k7  R-US_R0402  [R0402]
R11  4k7  R-US_R0402  [R0402]
R14  4k7  R-US_R0402  [R0402]
R15  120R  R-US_R0402  [R0402]
R27  10k  R-US_R0402  [R0402]
R29  10k  R-US_R0402  [R0402]
R33  10k  R-US_R0402  [R0402]
R40  27k  R-US_R0402  [R0402]
R41  27k  R-US_R0402  [R0402]
R42  10K  R-US_R0402  [R0402]
R43  10K  R-US_R0402  [R0402]
R46  100K  R-US_R0402  [R0402]
R58  100K  R-US_R0402  [R0402]
U3  ADUM1250  [SO8-COOL]
U6  MCP6002T-I_MS  [SOP65P490X110-8N]

### Nets
+3V3: C3.1 C27.1 R8.2 R9.2 R11.2 R14.2 R33.2 U3.1(VDD1) U3.8(VDD2) U6.8(VDD) ; supply symbol labelled +3V3-F ; also sheet 1,2,3,5,7
CA: C26.1 R27.2 R41.2 U6.3(VINA+)
CB: C25.1 R29.2 R40.2 U6.5(VINB+)
EMG_A: R42.1 U6.1(VOUTA) ; also sheet 2
EMG_B: R43.1 U6.7(VOUTB) ; also sheet 2
GND: C3.2 C25.2 C26.2 C27.2 D1.A D3.A Q1.2(S2) Q1.4(D2) R46.2 R58.2 U3.4(GND1) U3.5(GND2) U6.4(VSS) ; also sheet 1,2,3,4,5,7
INT_EMG: Q1.5(S1) Q1.6(D1) R33.1 ; also sheet 2
N$1: J8.3 R7.1
N$2: D3.C R11.1 R15.2 U3.7(SDA2)
N$5: Q1.1(G1) R27.1
N$7: Q1.3(G2) R29.1
N$27: J8.4 R15.1
N$30: R42.2 R46.1 U6.2(VINA-)
N$31: R43.2 R58.1 U6.6(VINB-)
N$32: D1.C R7.2 R14.1 U3.6(SCL2)
N$33: J8.2 R40.1
N$34: J8.1 R41.1
SCL: R9.1 U3.3(SCL1) ; also sheet 2,4
SDA: R8.1 U3.2(SDA1) ; also sheet 2,4

### Notes on the sheet
- Usado 18k
- Usado 2,2uF
- Conector com duas funçoes:
  Pinos 1 e 2 recebe os sinais de controle para o movimento dos dedos, com filtro passa baixa.
  Pinos 3 e 4 para comunicaçao I2C, o qual passa por um CI isolador.
  Conector M.: SM04B-NSHSS-TB (LF)(SN)
  Conector F.: NSHR-04V-S
  Terminal: SSHL-003T-P0.2
- Usado 18k
- Usado 2,2uF
- Amplificador dos canais de EMG, usando como buffer.
- Porta NAND que ativa acionamento por EMG.
- Usado 191k
- Usado 191k
- Eng. Vinicius, Eber e Prof. Alcimar
- Usado DMS2300U
- EMG e Comunicação I2C
- BIOLAB

## Sheet 7 of 7
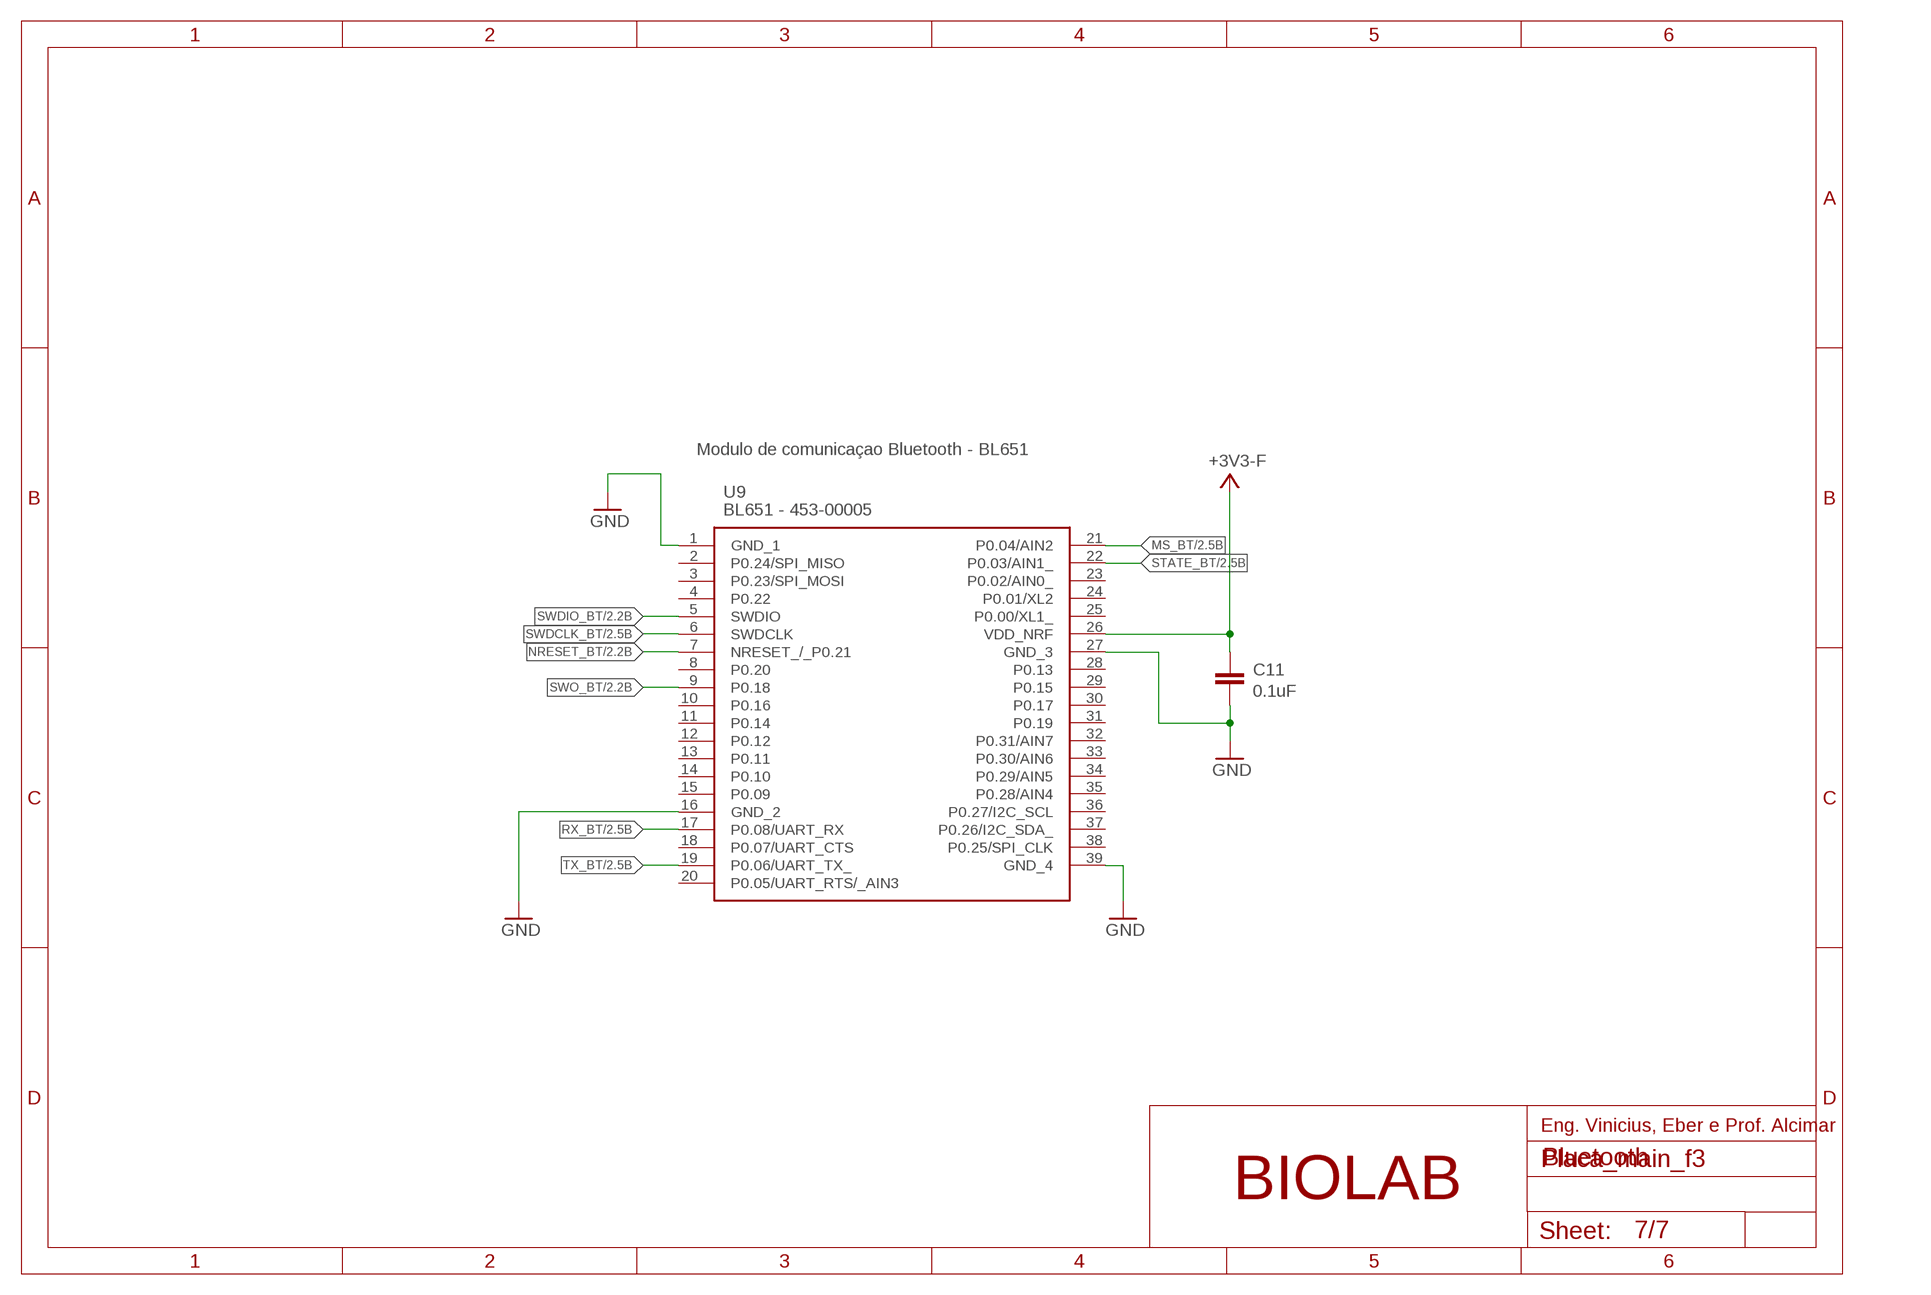
[diagram p6: schematic, sheet 7]

### Parts
C11  0.1uF  C-EUC0402K  [C0402K]
U9  BL651 - 453-00005  453-00005  [45300005]

### Nets
+3V3: C11.2 U9.26(VDD_NRF) ; supply symbol labelled +3V3-F ; also sheet 1,2,3,5,6
GND: C11.1 U9.1(GND_1) U9.16(GND_2) U9.27(GND_3) U9.39(GND_4) ; also sheet 1,2,3,4,5,6
MS_BT: U9.21(P0.04/AIN2) ; also sheet 2
NRESET_BT: U9.7(NRESET_/_P0.21) ; also sheet 2
RX_BT: U9.17(P0.08/UART_RX) ; also sheet 2
STATE_BT: U9.22(P0.03/AIN1_) ; also sheet 2
SWDCLK_BT: U9.6(SWDCLK) ; also sheet 2
SWDIO_BT: U9.5(SWDIO) ; also sheet 2
SWO_BT: U9.9(P0.18) ; also sheet 2
TX_BT: U9.19(P0.06/UART_TX_) ; also sheet 2
Unconnected: U9.2(P0.24/SPI_MISO) U9.3(P0.23/SPI_MOSI) U9.4(P0.22) U9.8(P0.20) U9.10(P0.16) U9.11(P0.14) U9.12(P0.12) U9.13(P0.11) U9.14(P0.10) U9.15(P0.09) U9.18(P0.07/UART_CTS) U9.20(P0.05/UART_RTS/_AIN3) U9.23(P0.02/AIN0_) U9.24(P0.01/XL2) U9.25(P0.00/XL1_) U9.28(P0.13) U9.29(P0.15) U9.30(P0.17) U9.31(P0.19) U9.32(P0.31/AIN7) U9.33(P0.30/AIN6) U9.34(P0.29/AIN5) U9.35(P0.28/AIN4) U9.36(P0.27/I2C_SCL) U9.37(P0.26/I2C_SDA_) U9.38(P0.25/SPI_CLK)

### Notes on the sheet
- Modulo de comunicaçao Bluetooth - BL651
- Eng. Vinicius, Eber e Prof. Alcimar
- Bluetooth
- BIOLAB

## Library data of the parts
C1-C17 C20 C21 C23-C27 C30-C32 C34 C35 = rcl:C-EU: CAPACITOR, European symbol
D1 D3 D33 = diode:DIODE-: DIODE
D2 = diode:BAT54: Schottky Diodes Source: Fairchild .. BAT54.pdf
J1-J4 J7 J9 = 501568-0607:501568-0607: MOLEX - 501568-0607 - HEADER, 1.00MM, 6WAY Source: Datasheet <http://www.molex.com/pdm_docs/sd/5015680607_sd.pdf>; ALLIED_NUMBER: 70372952; ALLIED_PRICE-STOCK: https://www.alliedelec.com/molex-incorporated-501568-0607/70372952/; DESCRIPTION: MOLEX - 501568-0607 - HEADER, 1.00MM, 6WAY; HEIGHT: mm; MANUFACTURER_NAME: Molex; MANUFACTURER_PART_NUMBER: 501568-0607; MOUSER_PART_NUMBER: 538-501568-0607; MOUSER_PRICE-STOCK: https://www.mouser.co.uk/ProductDetail/Molex/501568-0607?qs=uEWtSLL707W5cp1jFOkIrg%3D%3D; RS_PART_NUMBER: 0406714P; RS_PRICE-STOCK: http://uk.rs-online.com/web/p/products/0406714P
J5 J6 J10 = 501568-0207:501568-0207: Molex PICO-CLASP Series, Series Number 501568, 1mm Pitch 2 Way 2 Row Right Angle PCB Header, Solder Termination, 1A Source: Datasheet <https://www.molex.com/pdm_docs/sd/5015680207_sd.pdf>; DESCRIPTION: Molex PICO-CLASP Series, Series Number 501568, 1mm Pitch 2 Way 2 Row Right Angle PCB Header, Solder Termination, 1A; HEIGHT: 3.4mm; MANUFACTURER_NAME: Molex; MANUFACTURER_PART_NUMBER: 501568-0207; MOUSER_PART_NUMBER: 538-501568-0207; MOUSER_PRICE-STOCK: https://www.mouser.co.uk/ProductDetail/Molex/501568-0207?qs=uEWtSLL707WbFjnit2JOEg%3D%3D
J8 = 501568-0407:501568-0407: MOLEX - 501568-0407 - HEADER, 1.00MM, 4WAY Source: Datasheet <https://componentsearchengine.com/Datasheets/1/501568-0407.pdf>; ALLIED_NUMBER: 70372951; ALLIED_PRICE-STOCK: https://www.alliedelec.com/molex-incorporated-501568-0407/70372951/; DESCRIPTION: MOLEX - 501568-0407 - HEADER, 1.00MM, 4WAY; HEIGHT: mm; MANUFACTURER_NAME: Molex; MANUFACTURER_PART_NUMBER: 501568-0407; MOUSER_PART_NUMBER: 538-501568-0407; MOUSER_PRICE-STOCK: https://www.mouser.co.uk/ProductDetail/Molex/501568-0407?qs=uEWtSLL707XxbhccfDRWNQ%3D%3D; RS_PART_NUMBER: 0406710P; RS_PRICE-STOCK: http://uk.rs-online.com/web/p/products/0406710P
L1 L3 = rcl:L-US: INDUCTOR, American symbol
OSC1 = crystal:ASE: 3.3Vdc CMOS SMD CRYSTAL CLOCK OSCILLATOR SOurce: www.abracon.com; OC_FARNELL: unknown; OC_NEWARK: unknown
Q1 = DMN2215UDM-7:DMN2215UDM-7: Diodes Inc DMN2215UDM-7 Dual N-channel MOSFET Transistor, 2 A, 20 V, 6-Pin SOT-26 Source: Datasheet <https://www.diodes.com/assets/Datasheets/ds31176.pdf>; DESCRIPTION: Diodes Inc DMN2215UDM-7 Dual N-channel MOSFET Transistor, 2 A, 20 V, 6-Pin SOT-26; HEIGHT: 1.4mm; MANUFACTURER_NAME: Diodes Inc.; MANUFACTURER_PART_NUMBER: DMN2215UDM-7; MOUSER_PART_NUMBER: 621-DMN2215UDM-7; MOUSER_PRICE-STOCK: https://www.mouser.co.uk/ProductDetail/Diodes-Incorporated/DMN2215UDM-7?qs=ptj1V1atRArXZWZ7Y9ryoQ%3D%3D
Q2 Q3 = DMN2300U-7:DMN2300U-7: 20V N-Channel Enhancement MOSFET SOT-23 Diodes Inc DMN2300U-7 N-channel MOSFET Transistor, 1.4 A, 20 V, 3-Pin SOT-23 Source: Datasheet; DESCRIPTION: 20V N-Channel Enhancement MOSFET SOT-23 Diodes Inc DMN2300U-7 N-channel MOSFET Transistor, 1.4 A, 20 V, 3-Pin SOT-23; HEIGHT: 1.1mm; MANUFACTURER_NAME: Diodes Inc.; MANUFACTURER_PART_NUMBER: DMN2300U-7; MOUSER_PART_NUMBER: 621-DMN2300U-7; MOUSER_PRICE-STOCK: https://www.mouser.co.uk/ProductDetail/Diodes-Incorporated/DMN2300U-7?qs=EumP11lMQtOINdAJqf8F6Q%3D%3D
Q4 = DMP2240UDM-7:DMP2240UDM-7: Diodes Inc DMP2240UDM-7 Dual P-channel MOSFET Transistor, 2 A, -20 V, 6-Pin SOT-26 Source: Datasheet <https://www.diodes.com/assets/Datasheets/ds31197.pdf>; DESCRIPTION: Diodes Inc DMP2240UDM-7 Dual P-channel MOSFET Transistor, 2 A, -20 V, 6-Pin SOT-26; HEIGHT: 1.4mm; MANUFACTURER_NAME: Diodes Inc.; MANUFACTURER_PART_NUMBER: DMP2240UDM-7; MOUSER_PART_NUMBER: 621-DMP2240UDM-7; MOUSER_PRICE-STOCK: https://www.mouser.co.uk/ProductDetail/Diodes-Incorporated/DMP2240UDM-7?qs=mno522deGfakW12JLK9H1A%3D%3D
Q7 = FDV303N:FDV303N: Digital FET, N-Channel; AVAILABILITY: Unavailable; DESCRIPTION: FD V303N Series N-Channel 25 V 0.45 Ohm Surface Mount Digital FET - SOT-23-3; MF: Fairchild Semiconductor; MP: FDV303N.; PACKAGE: SOT-23-3 Fairchild Semiconductor; PRICE: None
Q9 Q88 = FDS6675BZ:FDS6675BZ: FDS6675BZ, P-channel MOSFET Transistor 11A 30V, 8-Pin SOIC Source: Datasheet; DESCRIPTION: FDS6675BZ, P-channel MOSFET Transistor 11A 30V, 8-Pin SOIC; HEIGHT: 1.75mm; MANUFACTURER_NAME: ON Semiconductor; MANUFACTURER_PART_NUMBER: FDS6675BZ; MOUSER_PART_NUMBER: 512-FDS6675BZ; MOUSER_PRICE-STOCK: https://www.mouser.co.uk/ProductDetail/ON-Semiconductor-Fairchild/FDS6675BZ?qs=QGk6feVlqMIIlsKkGfvkgA%3D%3D
R1-R3 R5-R11 R14 R15 R18 R26-R30 R32-R37 R40-R44 R46 R49-R51 R54-R58 = rcl:R-US_: RESISTOR, American symbol
U1 = TPS62111RSAT:TPS62111RSAT: 3.3-V, 1.5-A, 17-V Vin Step-Down Converter in QFN-16 Source: Datasheet <http://www.ti.com/lit/gpn/tps62111>; DESCRIPTION: 3.3-V, 1.5-A, 17-V Vin Step-Down Converter in QFN-16; HEIGHT: 1mm; MANUFACTURER_NAME: Texas Instruments; MANUFACTURER_PART_NUMBER: TPS62111RSAT; MOUSER_PART_NUMBER: 595-TPS62111RSAT; MOUSER_PRICE-STOCK: https://www.mouser.co.uk/ProductDetail/Texas-Instruments/TPS62111RSAT?qs=Gse6rAGbi7%2FXYp5rR0x3tg%3D%3D
U2 = allegro:A3906: Low Voltage Stepper and Single/Dual DC Motor Driver Data Sheet <http://www.allegromicro.com/en/Products/Part_Numbers/3906/3906.pdf>
U3 = ADUM1250:ADUM1250: Hot Swappable, Dual I2C Isolators Source: http://www.analog.com/static/imported-files/data_sheets/ADUM1250_1251.pdf; AVAILABILITY: Unavailable; DESCRIPTION: I²C Digital Isolator 2500Vrms 2 Channel 1Mbps 25kV/µs CMTI 8-SOIC _0.154, 3.90mm Width_; MF: Analog Devices; MP: ADUM1250; PACKAGE: SOIC-8 Analog Devices; PRICE: None
U4 = DSPIC33FJ128MC804-I_PT:DSPIC33FJ128MC804-I/PT: Digital Signal Controllers; AVAILABILITY: Unavailable; DESCRIPTION: dsPIC dsPIC™ 33F Microcontroller IC 16-Bit 40 MIPs 128KB _128K x 8_ FLASH 44-TQFP _10x10_; MF: Microchip; MP: DSPIC33FJ128MC804-I/PT; PACKAGE: TQFP-44 Microchip; PRICE: None
U5 = MCP601T-I_OT:MCP601T-I_OT: 2.7 to 5.5V CMOS Operational Amplifier Source: Datasheet <http://ww1.microchip.com/downloads/en/DeviceDoc/21178H.pdf>; DESCRIPTION: 2.7 to 5.5V CMOS Operational Amplifier; HEIGHT: 1.45mm; MANUFACTURER_NAME: Microchip; MANUFACTURER_PART_NUMBER: MCP601T-I/OT; MOUSER_PART_NUMBER: 579-MCP601T-I/OT; MOUSER_PRICE-STOCK: https://www.mouser.co.uk/ProductDetail/Microchip-Technology/MCP601T-I-OT?qs=TQnwojwsYvgI5ywjvKCAVw%3D%3D
U6 = MCP6002T-I_MS:MCP6002T-I_MS: MCP6002T-I/MS Microchip,, Op Amp, RRIO, 1MHz, 1.8 6 V, 8-Pin MSOP Source: Datasheet <https://ww1.microchip.com/downloads/en/DeviceDoc/21733j.pdf>; DESCRIPTION: MCP6002T-I/MS Microchip,, Op Amp, RRIO, 1MHz, 1.8 6 V, 8-Pin MSOP; HEIGHT: 1.1mm; MANUFACTURER_NAME: Microchip; MANUFACTURER_PART_NUMBER: MCP6002T-I/MS; MOUSER_PART_NUMBER: 579-MCP6002T-I/MS; MOUSER_PRICE-STOCK: https://www.mouser.co.uk/ProductDetail/Microchip-Technology/MCP6002T-I-MS?qs=Q%2Fw7XRh99inDxHLK1Co8Rw%3D%3D
U7 U8 = MIC5219-5.0YM5-TR:MIC5219-5.0YM5-TR: LDO Voltage Regulators 500mA Peak 1% Low Noise LDO Source: Datasheet <http://ww1.microchip.com/downloads/en/DeviceDoc/MIC5219-500mA-Peak-Output-LDO-Regulator-DS20006021A.pdf>; DESCRIPTION: LDO Voltage Regulators 500mA Peak 1% Low Noise LDO; HEIGHT: 1.45mm; MANUFACTURER_NAME: Microchip; MANUFACTURER_PART_NUMBER: MIC5219-5.0YM5-TR; MOUSER_PART_NUMBER: 998-MIC5219-5.0YM5TR; MOUSER_PRICE-STOCK: https://www.mouser.co.uk/ProductDetail/Microchip-Technology-Micrel/MIC5219-50YM5-TR?qs=U6T8BxXiZAXThrqii9sAvA%3D%3D
U9 = SamacSys_Parts:453-00005: Bluetooth Modules (802.15.1) BL651 Series - Bluetooth v5 Module, Int. Antenna (Nordic nRF52810) Tape & Reel Source: Datasheet <https://componentsearchengine.com/Datasheets/1/453-00005.pdf>; DESCRIPTION: Bluetooth Modules (802.15.1) BL651 Series - Bluetooth v5 Module, Int. Antenna (Nordic nRF52810) Tape & Reel; HEIGHT: 2.2mm; MANUFACTURER_NAME: Laird Technologies; MANUFACTURER_PART_NUMBER: 453-00005; MOUSER_PART_NUMBER: 239-453-00005; MOUSER_PRICE-STOCK: https://www.mouser.com/Search/Refine.aspx?Keyword=239-453-00005